# EAGLE design atmega1284_oled (EAGLE 7.1.0)
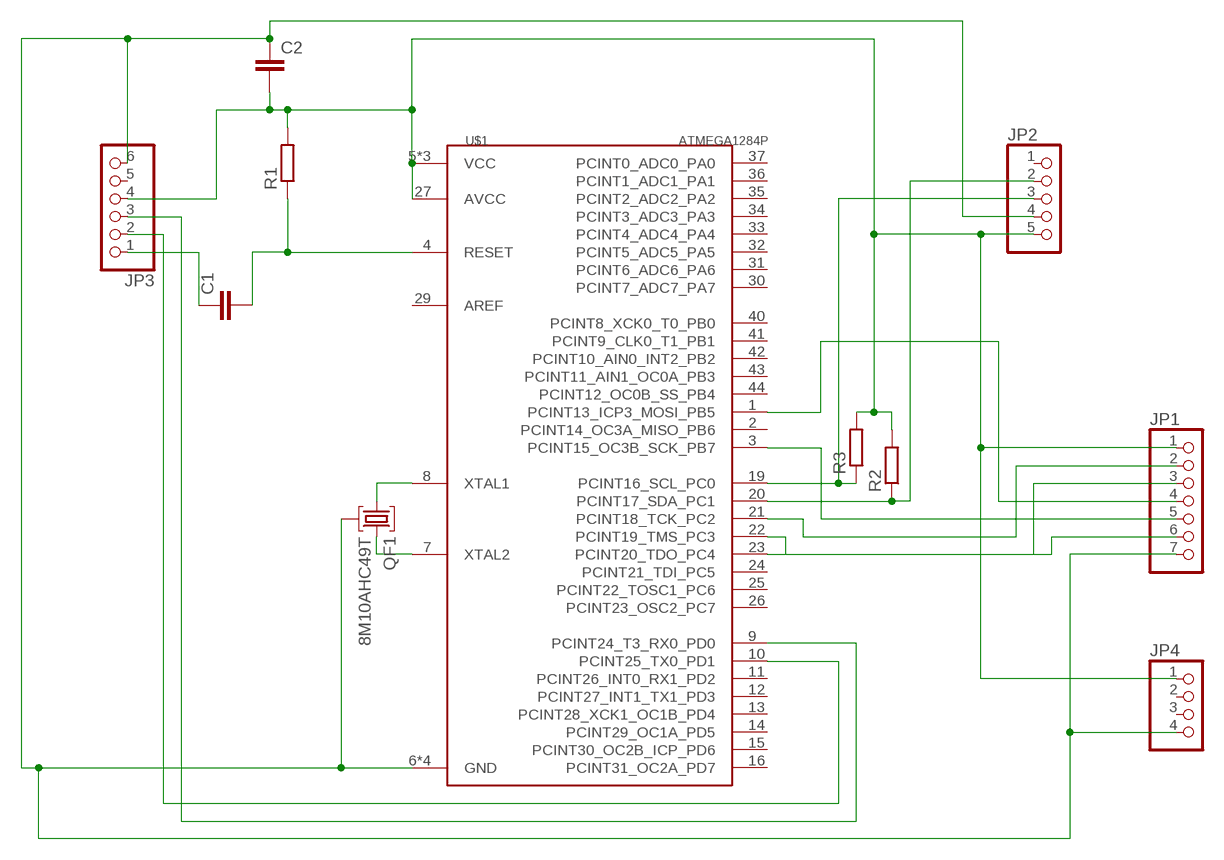
[diagram p0: schematic, sheet 1]

## Parts
C1  C-EUC0805  [C0805]
C2  C-EUC0805  [C0805]
JP1  PINHD-1X7  [1X07]
JP2  PINHD-1X5  [1X05]
JP3  PINHD-1X6  [1X06]
JP4  PINHD-1X4  [1X04]
QF1  8M10AHC49T  [HC49U]
R1  R-EU_R0805  [R0805]
R2  R-EU_R0805  [R0805]
R3  R-EU_R0805  [R0805]
U$1  ATMEGA1284P  [TQFP44]

## Nets
N$1: JP2.3 R3.1 U$1.19(PCINT16_SCL_PC0)
N$2: JP2.2 R2.1 U$1.20(PCINT17_SDA_PC1)
N$3: JP1.4 U$1.1(PCINT13_ICP3_MOSI_PB5)
N$4: C2.2 JP1.1 JP2.5 JP3.4 JP4.1 R1.2 R2.2 R3.2 U$1.5(VCC) U$1.17(VCC) U$1.27(AVCC) U$1.38(VCC)
N$5: QF1.1 U$1.8(XTAL1)
N$6: QF1.3 U$1.7(XTAL2)
N$7: C2.1 JP1.7 JP2.4 JP3.6 JP4.4 QF1.2 U$1.6(GND) U$1.18(GND) U$1.28(GND) U$1.39(GND)
N$8: JP1.5 U$1.3(PCINT15_OC3B_SCK_PB7)
N$9: JP1.2 U$1.21(PCINT18_TCK_PC2)
N$10: C1.2 R1.1 U$1.4(RESET)
N$11: C1.1 JP3.1
N$12: JP3.2 U$1.10(PCINT25_TX0_PD1)
N$13: JP3.3 U$1.9(PCINT24_T3_RX0_PD0)
N$14: JP1.3 U$1.22(PCINT19_TMS_PC3)
N$15: JP1.6 U$1.23(PCINT20_TDO_PC4)
Unconnected: JP2.1 JP3.5 JP4.2 JP4.3 U$1.2(PCINT14_OC3A_MISO_PB6) U$1.11(PCINT26_INT0_RX1_PD2) U$1.12(PCINT27_INT1_TX1_PD3) U$1.13(PCINT28_XCK1_OC1B_PD4) U$1.14(PCINT29_OC1A_PD5) U$1.15(PCINT30_OC2B_ICP_PD6) U$1.16(PCINT31_OC2A_PD7) U$1.24(PCINT21_TDI_PC5) U$1.25(PCINT22_TOSC1_PC6) U$1.26(PCINT23_OSC2_PC7) U$1.29(AREF) U$1.30(PCINT7_ADC7_PA7) U$1.31(PCINT6_ADC6_PA6) U$1.32(PCINT5_ADC5_PA5) U$1.33(PCINT4_ADC4_PA4) U$1.34(PCINT3_ADC3_PA3) U$1.35(PCINT2_ADC2_PA2) U$1.36(PCINT1_ADC1_PA1) U$1.37(PCINT0_ADC0_PA0) U$1.40(PCINT8_XCK0_T0_PB0) U$1.41(PCINT9_CLK0_T1_PB1) U$1.42(PCINT10_AIN0_INT2_PB2) U$1.43(PCINT11_AIN1_OC0A_PB3) U$1.44(PCINT12_OC0B_SS_PB4)

## Library data of the parts
C1 C2 = rcl:C-EU: CAPACITOR, European symbol
JP1 = pinhead:PINHD-1X7: PIN HEADER
JP2 = pinhead:PINHD-1X5: PIN HEADER
JP3 = pinhead:PINHD-1X6: PIN HEADER
JP4 = pinhead:PINHD-1X4: PIN HEADER
QF1 = crystal:8M10AHC49T: Monolithic Crystal Filters Source: www.vanlong.com; OC_FARNELL: unknown; OC_NEWARK: unknown
R1-R3 = rcl:R-EU_: RESISTOR, European symbol
U$1 = Stephanie_Parts:ATMEGA1284P: My version schematic & footprint for the ATMega1284P TQFP-44 package. Matches digikey part ATMEGA1284P-AU-ND. Tested & working.

## Board
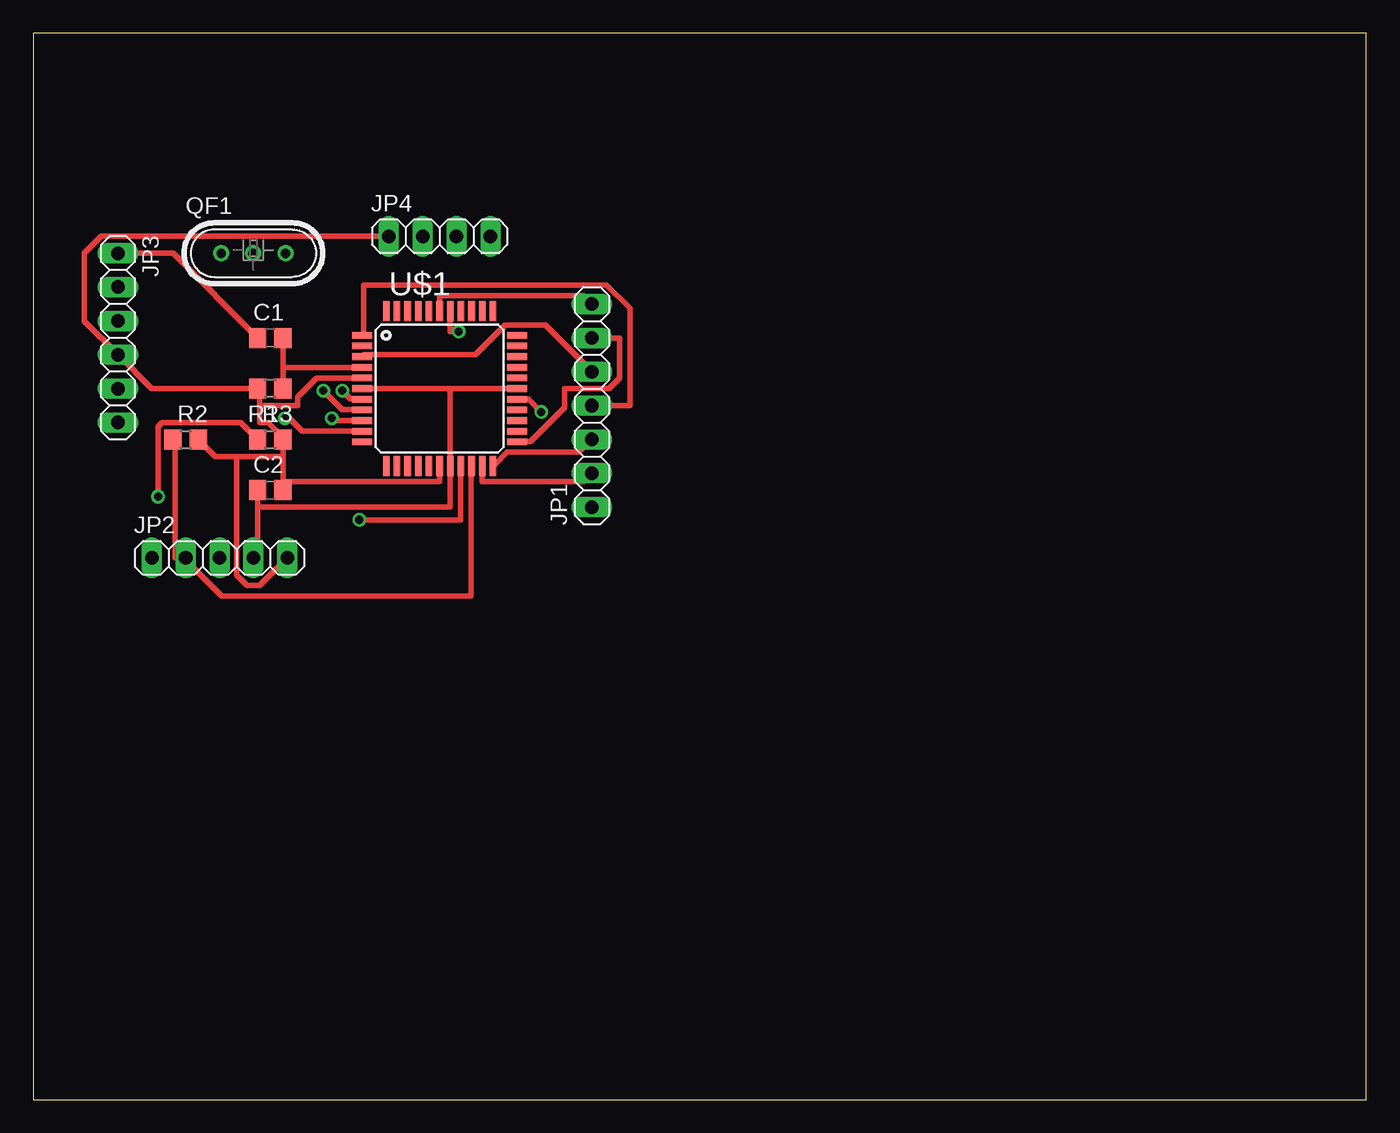
[diagram p1: board, top side]
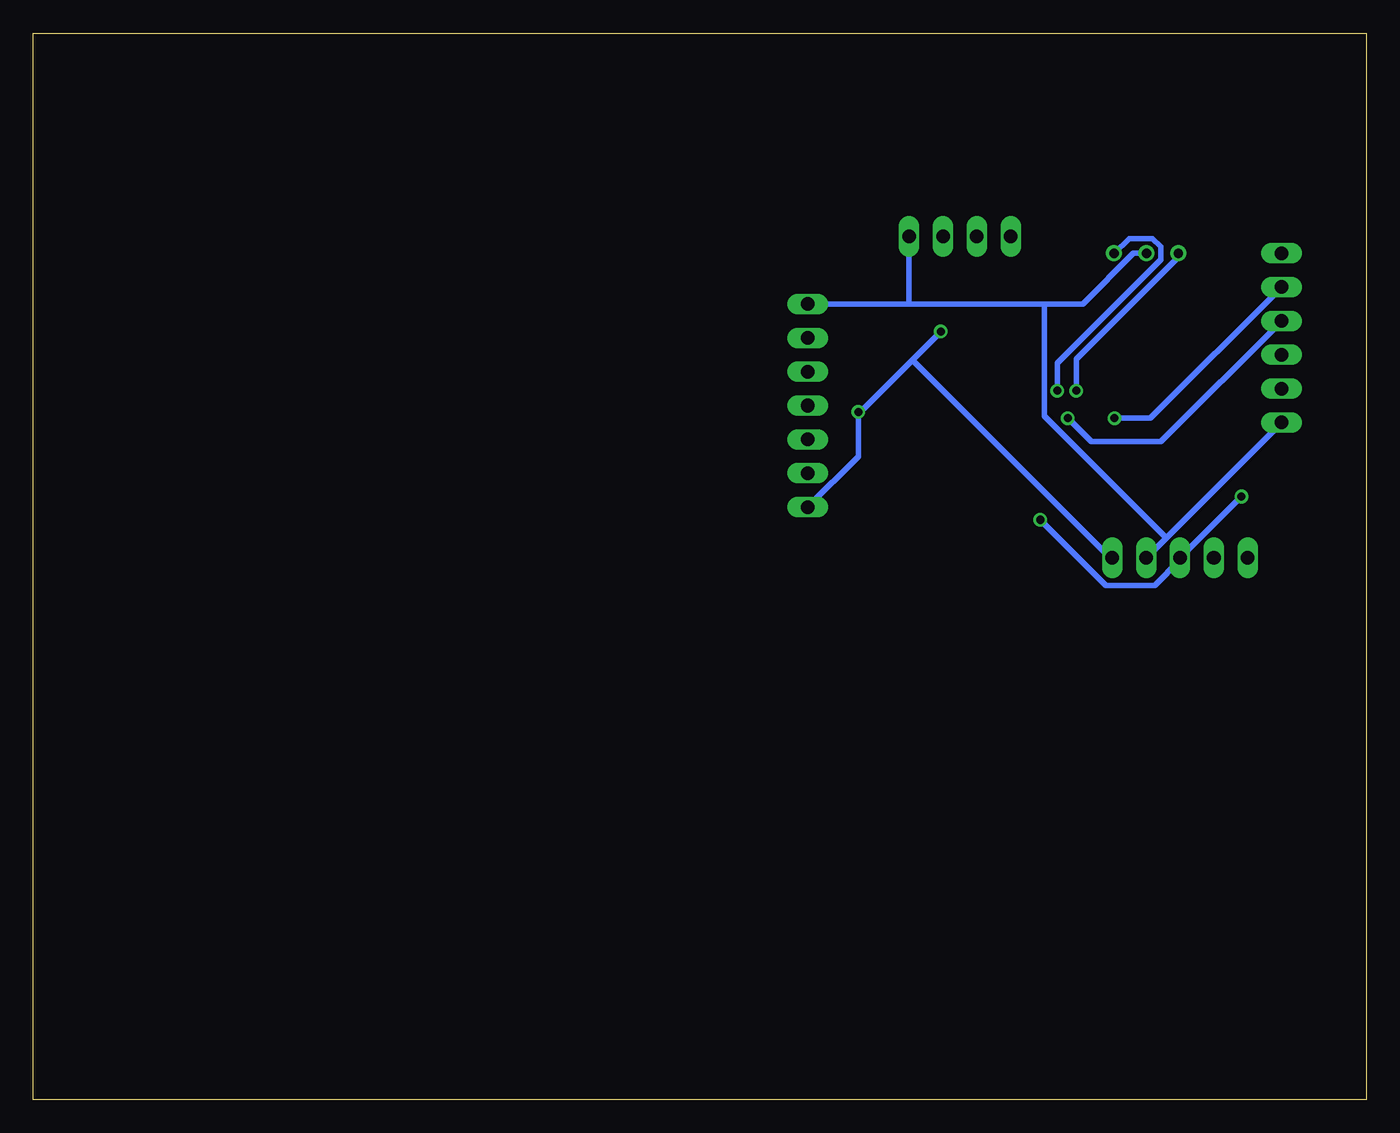
[diagram p2: board, bottom side, seen from below]

Size 100 x 80 mm. Coordinates in mm from the lower left corner, seen from the top.
Outline: 0,0 100,0 100,80 0,80 0,0
Copper layers (1*16): Top 0.035mm / dielectric 2mm / Bottom 0.035mm
Design rules "default *": minimum track width 16mil, minimum drill 24mil, track to track 12mil, track to pad 8mil, pad to pad 8mil, via to via 8mil, smd to smd 10mil, copper to edge 40mil, drill to drill 8mil, minimum pad ring 10mil, minimum via ring 8mil, stop-mask expansion 4mil, vias tented up to drill 0mil, thermal gap 10mil

### Footprints (pad centres in the part's own frame; a part is rotated, then mirrored left to right if it is on the bottom)
C0805 = smd 1.3 x 1.5: 1 -0.95,0; 2 0.95,0
1X07 = drill 1.016 long: 1 -7.62,0; 2 -5.08,0; 3 -2.54,0; 4 0,0; 5 2.54,0; 6 5.08,0; 7 7.62,0
1X05 = drill 1.016 long: 1 -5.08,0; 2 -2.54,0; 3 0,0; 4 2.54,0; 5 5.08,0
1X06 = drill 1.016 long: 1 -6.35,0; 2 -3.81,0; 3 -1.27,0; 4 1.27,0; 5 3.81,0; 6 6.35,0
1X04 = drill 1.016 long: 1 -3.81,0; 2 -1.27,0; 3 1.27,0; 4 3.81,0
HC49U = drill 0.7 pad 1.2: 1 -2.413,0; 2 -0.027,0; 3 2.413,0
R0805 = smd 1.3 x 1.5: 1 -0.95,0; 2 0.95,0
TQFP44 = smd 1.5 x 0.5: 1 -5.8,4; 2 -5.8,3.2; 3 -5.8,2.4; 4 -5.8,1.6; 5 -5.8,0.8; 6 -5.8,0; 7 -5.8,-0.8; 8 -5.8,-1.6; 9 -5.8,-2.4; 10 -5.8,-3.2; 11 -5.8,-4; 23 5.8,-4; 24 5.8,-3.2; 25 5.8,-2.4; 26 5.8,-1.6; 27 5.8,-0.8; 28 5.8,0; 29 5.8,0.8; 30 5.8,1.6; 31 5.8,2.4; 32 5.8,3.2; 33 5.8,4 | smd 0.5 x 1.5: 12 -4,-5.8; 13 -3.2,-5.8; 14 -2.4,-5.8; 15 -1.6,-5.8; 16 -0.8,-5.8; 17 0,-5.8; 18 0.8,-5.8; 19 1.6,-5.8; 20 2.4,-5.8; 21 3.2,-5.8; 22 4,-5.8; 34 4,5.8; 35 3.2,5.8; 36 2.4,5.8; 37 1.6,5.8; 38 0.8,5.8; 39 0,5.8; 40 -0.8,5.8; 41 -1.6,5.8; 42 -2.4,5.8; 43 -3.2,5.8; 44 -4,5.8

### Placement (x,y rotation side)
C1  17.78,57.15 0 top
C2  17.78,45.72 0 top
JP1  41.91,52.07 90 top
JP2  13.97,40.64 0 top
JP3  6.35,57.15 270 top
JP4  30.48,64.77 0 top
QF1  16.51,63.5 0 top
R1  17.78,53.34 180 top
R2  11.43,49.53 0 top
R3  17.78,49.53 0 top
U$1  30.48,53.34 0 top

### Tracks (layer width: path | path; a pad name or v marks a point on that pad's centre or on a via)
N$1  (via drill 0.61)
  Top 0.406: v9.37,45.24 9.37,50.48 9.68,50.8 15.56,50.8 R3.1 | v24.45,43.5 32.07,43.5 32.07,47.47 U$1.19
  Bottom 0.406: v9.37,45.24 JP2.3 13.97,40.48 15.88,38.58 19.53,38.58 v24.45,43.5
N$2
  Top 0.406: R2.1 10.64,49.53 10.64,40.64 JP2.2 11.43,40.48 14.13,37.78 32.86,37.78 32.86,47.47 U$1.20
N$3
  Top 0.406: JP1.4 44.77,52.07 44.77,59.37 43.02,61.12 24.77,61.12 24.77,57.47 U$1.1
N$4  (via drill 0.61)
  Top 0.406: v38.1,51.59 37.15,52.55 36.35,52.55 U$1.27 | v31.91,57.63 31.27,57.63 31.27,59.05 U$1.38 | 18.73,48.26 R3.2 18.73,49.69 17.62,50.8 16.99,50.8 16.99,52.07 | 18.73,48.26 C2.2 18.89,46.35 30.48,46.35 U$1.17 | 18.73,48.26 15.24,48.26 | 15.24,48.26 13.65,48.26 R2.2 | 16.99,52.07 16.99,53.34 R1.2 8.89,53.34 JP3.4 3.81,58.42 3.81,63.5 5.08,64.77 JP4.1 | 16.99,52.07 19.84,52.07 19.84,52.7 21.27,54.13 24.61,54.13 U$1.5 | JP2.5 16.99,38.58 16.03,38.58 15.24,39.37 15.24,48.26
  Bottom 0.406: JP1.1 38.1,48.26 v38.1,51.59 37.94,51.59 34.05,55.48 | 34.05,55.48 v31.91,57.63 | 34.05,55.48 19.21,40.64 JP2.5
N$5  (via drill 0.61)
  Top 0.406: v21.75,53.18 23.18,51.75 24.61,51.75 U$1.8
  Bottom 0.406: v21.75,53.18 21.75,55.56 14.13,63.18 14.13,63.5 QF1.1
N$6  (via drill 0.61)
  Top 0.406: v23.18,53.18 23.81,52.55 24.61,52.55 U$1.7
  Bottom 0.406: v23.18,53.18 23.18,55.24 15.4,63.02 15.4,63.98 16.03,64.61 17.78,64.61 18.89,63.5 QF1.3
N$7
  Top 0.406: U$1.39 30.48,60.33 41.27,60.33 JP1.7 | 31.27,53.34 31.27,47.62 U$1.18 31.27,47.47 31.27,44.45 16.83,44.45 | U$1.28 31.27,53.34 | 31.27,53.34 U$1.6 | 16.83,44.45 16.83,40.64 JP2.4 | 16.83,44.45 C2.1
  Bottom 0.406: QF1.2 17.46,63.5 21.27,59.69 24.13,59.69 | JP1.7 34.29,59.69 | 34.29,59.69 24.13,59.69 | JP2.4 15,42.15 | 15,42.15 JP3.6 | 24.13,59.69 24.13,51.28 15,42.15 | 34.29,59.69 JP4.4
N$8
  Top 0.406: JP1.5 38.42,58.1 35.4,58.1 33.18,55.88 24.77,55.88 U$1.3
N$9
  Top 0.406: JP1.2 41.27,46.35 33.66,46.35 33.66,47.47 U$1.21
N$10
  Top 0.406: 18.73,54.93 C1.2 | 18.73,54.93 R1.1 | 18.73,54.93 24.61,54.93 U$1.4
N$11
  Top 0.406: JP3.1 10.48,63.5 C1.1
N$12  (via drill 0.61)
  Top 0.406: v18.89,51.12 19.21,51.12 20.16,50.16 24.61,50.16 U$1.10
  Bottom 0.406: v18.89,51.12 16.19,51.12 JP3.2
N$13  (via drill 0.61)
  Top 0.406: v22.38,51.12 22.54,50.96 24.61,50.96 U$1.9
  Bottom 0.406: v22.38,51.12 20.64,49.37 15.4,49.37 JP3.3
N$14
  Top 0.406: JP1.3 40.96,48.58 35.56,48.58 34.61,47.62 U$1.22
N$15
  Top 0.406: JP1.6 43.97,57.15 43.97,54.13 43.18,53.34 39.85,53.34 39.85,51.91 37.31,49.37 36.35,49.37 U$1.23